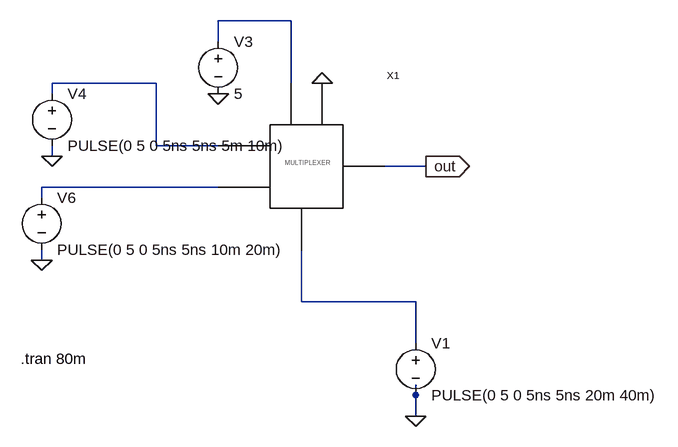
[diagram p0: schematic muximplytest.asc]
muximplytest.asc, the LTspice schematic file:
Version 4
SHEET 1 880 680
WIRE 224 -32 112 -32
WIRE 112 0 112 -32
WIRE 16 64 -144 64
WIRE 224 64 224 -32
WIRE -144 80 -144 64
WIRE 16 160 16 64
WIRE 112 160 16 160
WIRE -144 176 -144 160
WIRE 432 192 368 192
WIRE 112 224 -160 224
WIRE -160 240 -160 224
WIRE -160 336 -160 320
WIRE 240 400 240 320
WIRE 416 400 240 400
WIRE 416 464 416 400
WIRE 416 544 416 528
WIRE 416 576 416 544
FLAG 112 80 0
FLAG 272 64 0
FLAG 432 192 out
IOPIN 432 192 Out
FLAG -144 176 0
FLAG -160 336 0
FLAG 416 576 0
SYMBOL multiplexerimply 224 160 R0
SYMATTR InstName X1
SYMBOL voltage 112 -16 R0
WINDOW 123 0 0 Left 0
WINDOW 39 0 0 Left 0
SYMATTR InstName V3
SYMATTR Value 5
SYMBOL voltage -144 64 R0
WINDOW 123 0 0 Left 0
WINDOW 39 0 0 Left 0
SYMATTR InstName V4
SYMATTR Value PULSE(0 5 0 5ns 5ns 5m 10m)
SYMBOL voltage -160 224 R0
WINDOW 123 0 0 Left 0
WINDOW 39 0 0 Left 0
SYMATTR InstName V6
SYMATTR Value PULSE(0 5 0 5ns 5ns 10m 20m)
SYMBOL voltage 416 448 R0
WINDOW 123 0 0 Left 0
WINDOW 39 0 0 Left 0
SYMATTR InstName V1
SYMATTR Value PULSE(0 5 0 5ns 5ns 20m 40m)
TEXT -192 488 Left 2 !.tran 80m

The netlist it stands for:
* muximplytest.asc
XX1 N002 N003 N001 0 out N004 multiplexerimply  ; pins A B VDD VSS OUT S
V3 N001 0 5
V4 N002 0 PULSE(0 5 0 5ns 5ns 5m 10m)
V6 N003 0 PULSE(0 5 0 5ns 5ns 10m 20m)
V1 N004 0 PULSE(0 5 0 5ns 5ns 20m 40m)
.tran 80m
.backanno
.end